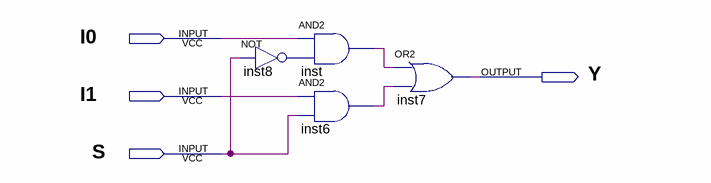
[diagram p0: schematic sheet]
// Quartus schematic 2x1_Mux.bdf as structural Verilog: 4 symbols, 4 pins
module \2x1_Mux  (
  input  I0,
  input  I1,
  input  S,
  output Y
);

  wire inst6_out, inst8_out, inst_out;

  and inst (inst_out, I0, inst8_out);
  not inst8 (inst8_out, S);
  and inst6 (inst6_out, I1, S);
  or inst7 (Y, inst_out, inst6_out);
endmodule
